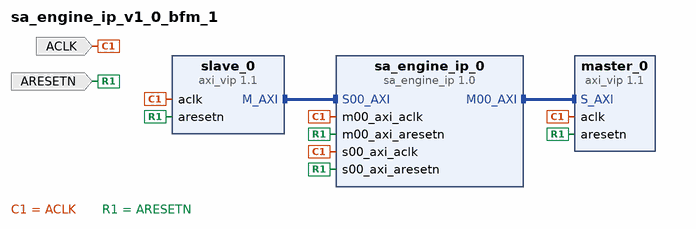
[diagram p0: block diagram of the top level]
# Vivado block design sa_engine_ip_v1_0_bfm_1, xc7z020clg400-1, Vivado 2021.2
create_bd_design sa_engine_ip_v1_0_bfm_1

create_bd_port -dir I -type clk ACLK
set_property -dict [list \
  CONFIG.ASSOCIATED_RESET ARESETN \
  CONFIG.CLK_DOMAIN sa_engine_ip_v1_0_bfm_1_ACLK \
  CONFIG.FREQ_HZ 100000000 \
  CONFIG.PHASE 0.000 \
] [get_bd_ports ACLK]
create_bd_port -dir I -type rst ARESETN
set_property -dict {CONFIG.POLARITY ACTIVE_LOW} [get_bd_ports ARESETN]

create_bd_cell -type ip -vlnv xilinx.com:ip:axi_vip:1.1 slave_0
set_property -dict [list \
  CONFIG.ADDR_WIDTH 32 \
  CONFIG.DATA_WIDTH 32 \
  CONFIG.HAS_BRESP 1 \
  CONFIG.HAS_PROT 1 \
  CONFIG.HAS_RRESP 1 \
  CONFIG.HAS_WSTRB 1 \
  CONFIG.INTERFACE_MODE MASTER \
  CONFIG.PROTOCOL AXI4LITE \
  CONFIG.READ_WRITE_MODE READ_WRITE \
] [get_bd_cells slave_0]
create_bd_cell -type ip -vlnv xilinx.com:ip:axi_vip:1.1 master_0
set_property -dict {CONFIG.INTERFACE_MODE SLAVE CONFIG.PROTOCOL AXI4} [get_bd_cells master_0]
create_bd_cell -type ip -vlnv jimin.hwang:user:sa_engine_ip:1.0 sa_engine_ip_0

# ---- connections ----

connect_bd_intf_net [get_bd_intf_pins sa_engine_ip_0/M00_AXI] [get_bd_intf_pins master_0/S_AXI]
connect_bd_intf_net [get_bd_intf_pins slave_0/M_AXI] [get_bd_intf_pins sa_engine_ip_0/S00_AXI]
connect_bd_net [get_bd_ports ACLK] \
  [get_bd_pins slave_0/aclk] [get_bd_pins master_0/aclk] [get_bd_pins sa_engine_ip_0/s00_axi_aclk] \
  [get_bd_pins sa_engine_ip_0/m00_axi_aclk]
connect_bd_net [get_bd_ports ARESETN] \
  [get_bd_pins slave_0/aresetn] [get_bd_pins master_0/aresetn] [get_bd_pins sa_engine_ip_0/s00_axi_aresetn] \
  [get_bd_pins sa_engine_ip_0/m00_axi_aresetn]

# ---- address map ----
assign_bd_address -offset 0x44A00000 -range 64K -target_address_space [get_bd_addr_spaces sa_engine_ip_0/M00_AXI] [get_bd_addr_segs master_0/S_AXI/Reg]
assign_bd_address -offset 0x44A00000 -range 64K -target_address_space [get_bd_addr_spaces slave_0/Master_AXI] [get_bd_addr_segs sa_engine_ip_0/S00_AXI/S00_AXI_reg]

validate_bd_design
save_bd_design
